# EasyEDA Pro project evenVCO.eprj, board PCB1_1
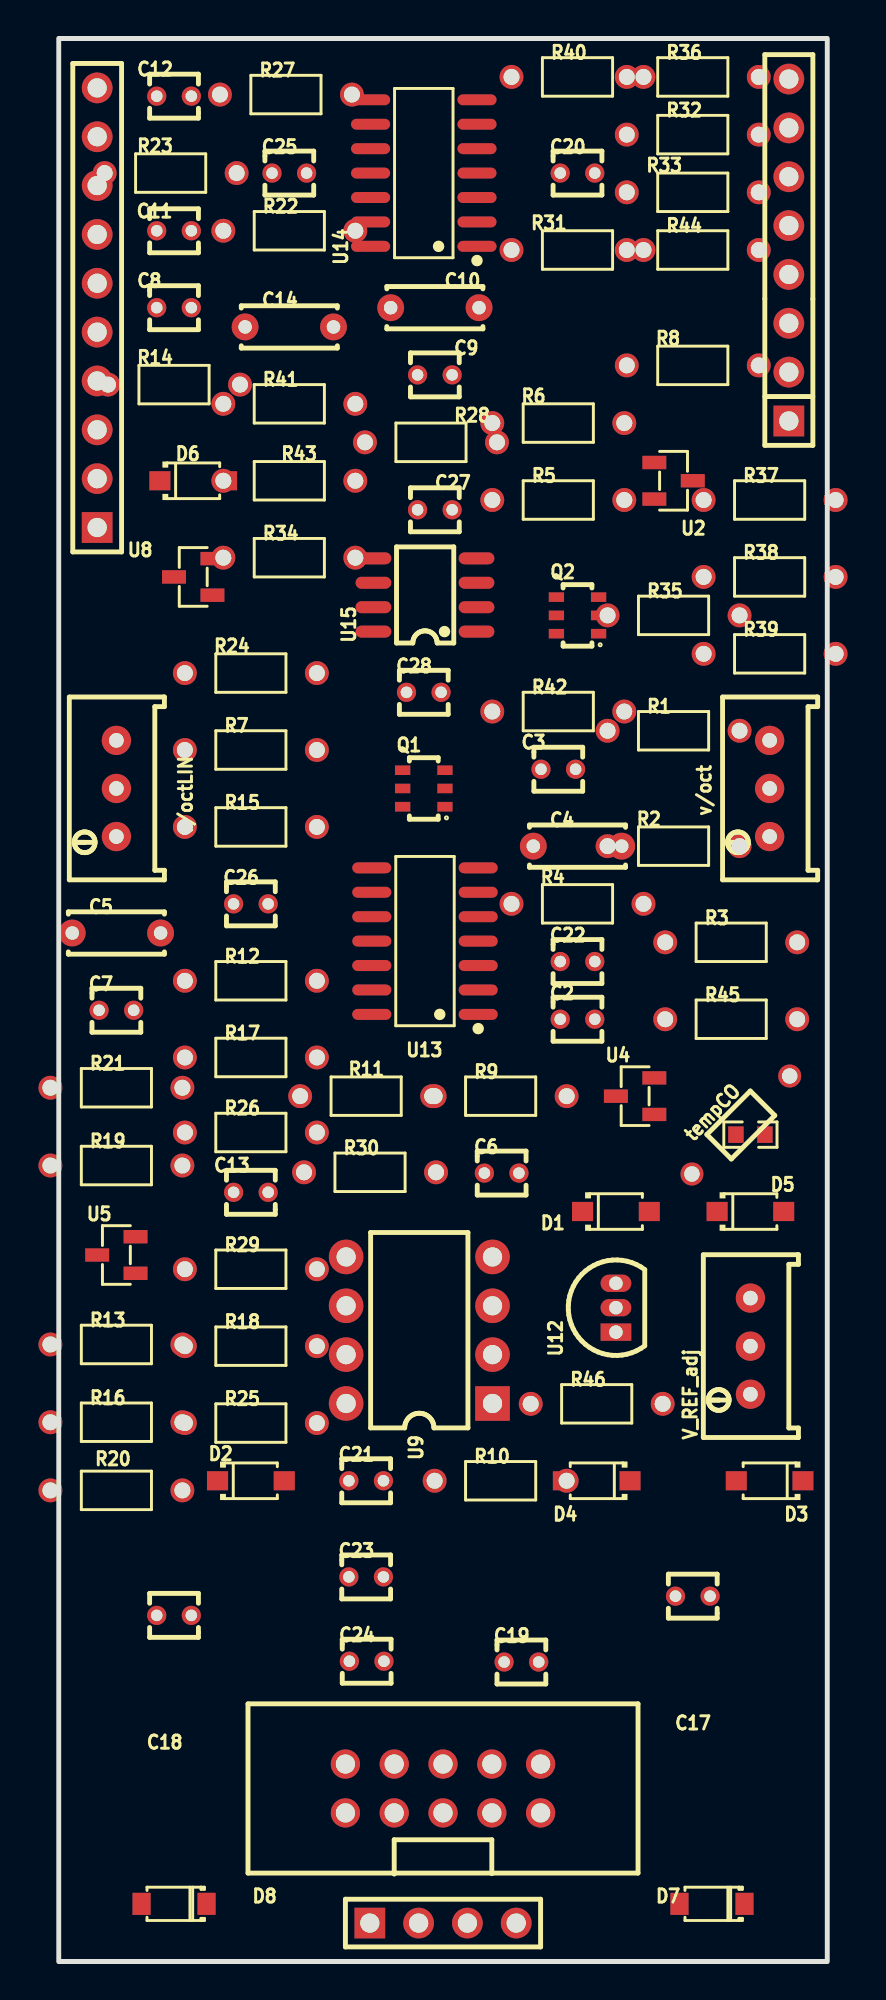
[diagram p8: board, top side]
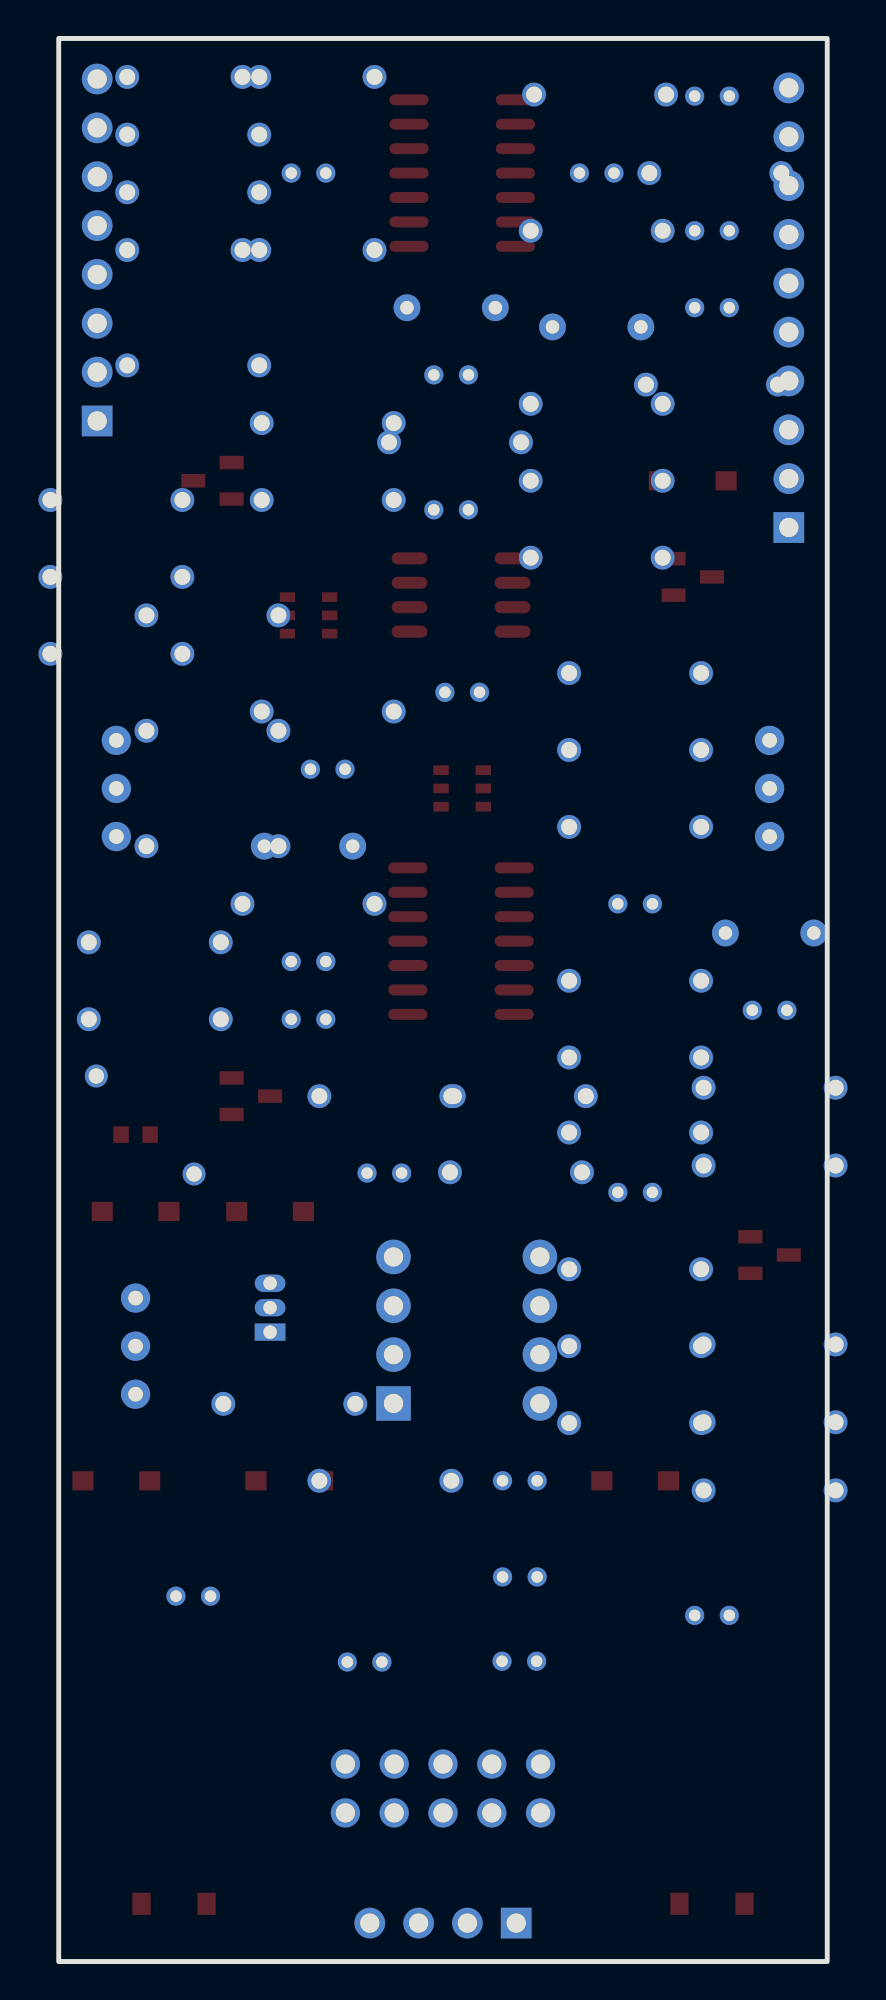
[diagram p9: board, bottom side, seen from below]

Outline 40 x 100 mm; copper layers: Top Layer, Bottom Layer. Coordinates in mm from the lower left corner of the outline.
Outline path: rectangle 0,100 40,0
Stack: Top Layer 0.035mm / Dielectric1 1.51mm FR4 er 4.5 / Bottom Layer 0.035mm

## Design rules (mm)
template: JLCPCB Capability(Two Layers Board)
spacing copperThickness1oz (default): track to track 0.102, other pairs 0.152 to 0.3
spacing copperThickness2oz: track to track 0.203, other pairs 0.152 to 0.3
track width copperThickness1oz (default): min 0.127, default 0.254, max 2.54
track width copperThickness2oz: min 0.203, default 0.254, max 2.54
differential pair differentialPair (default): width min 0.127, default 0.254, max 2.54; gap min 0.152, default 0.152
via viaSize (default): diameter min 0.5, default 0.61, max 10; hole min 0.3, default 0.305, max 6.3

## Placement (name value [footprint] x y rotation side)
C2  10nF  [CAP-TH_L2.5-W2.3-P1.80-D0.4]  27 49 0 top
C3  1nF  [CAP-TH_L2.5-W2.3-P1.80-D0.4]  26 62 0 top
C4  2.2nF styrene  [CAP-TH_L5.0-W2.1-P4.60-D0.4]  27 58 0 top
C5  680nF polyester  [CAP-TH_L5.0-W2.1-P4.60-D0.4]  3 53.48 0 top
C6  47pF  [CAP-TH_L2.5-W2.3-P1.80-D0.4]  23.05 41 0 top
C7  47pF  [CAP-TH_L2.5-W2.3-P1.80-D0.4]  3 49.47 0 top
C8  1nF  [CAP-TH_L2.5-W2.3-P1.80-D0.4]  6 86 0 top
C9  3pF  [CAP-TH_L2.5-W2.3-P1.80-D0.4]  19.58 82.51 0 top
C10  680nF  [CAP-TH_L5.0-W2.1-P4.60-D0.4]  19.58 86 0 top
C11  10pF  [CAP-TH_L2.5-W2.3-P1.80-D0.4]  6 90 180 top
C12  10pF  [CAP-TH_L2.5-W2.3-P1.80-D0.4]  6 97 180 top
C13  10pF  [CAP-TH_L2.5-W2.3-P1.80-D0.4]  10 40 180 top
C14  2.2nF  [CAP-TH_L5.0-W2.1-P4.60-D0.4]  12 85 0 top
C17  10uF  [CAP-TH_L2.5-W2.3-P1.80-D0.4]  33 19 180 top
C18  10uF  [CAP-TH_L2.5-W2.3-P1.80-D0.4]  6 18 180 top
C19  100nF  [CAP-TH_L2.5-W2.3-P1.80-D0.4]  24.08 15.58 0 top
C20  100nF  [CAP-TH_L2.5-W2.3-P1.80-D0.4]  27 93 0 top
C21  100nF  [CAP-TH_L2.5-W2.3-P1.80-D0.4]  16 25 0 top
C22  100nF  [CAP-TH_L2.5-W2.3-P1.80-D0.4]  27 52 0 top
C23  100nF  [CAP-TH_L2.5-W2.3-P1.80-D0.4]  16 20 0 top
C24  100nF  [CAP-TH_L2.5-W2.3-P1.80-D0.4]  16.03 15.62 0 top
C25  100nF  [CAP-TH_L2.5-W2.3-P1.80-D0.4]  12 93 0 top
C26  100nF  [CAP-TH_L2.5-W2.3-P1.80-D0.4]  10 55 0 top
C27  100nF  [CAP-TH_L2.5-W2.3-P1.80-D0.4]  19.58 75.49 0 top
C28  100nF  [CAP-TH_L2.5-W2.3-P1.80-D0.4]  19 66 0 top
D1  1N4148W  [SOD-123F_L2.7-W1.6-LS3.8-RD]  29 39 0 top
D2  1N4148W  [SOD-123F_L2.7-W1.6-LS3.8-RD]  10 25 0 top
D3  1N4148W  [SOD-123F_L2.7-W1.6-LS3.8-RD]  37 25 180 top
D4  1N4148W  [SOD-123F_L2.7-W1.6-LS3.8-RD]  28 25 180 top
D5  1N4148W  [SOD-123F_L2.7-W1.6-LS3.8-RD]  36 39 0 top
D6  1N4148W  [SOD-123F_L2.7-W1.6-LS3.8-RD]  7 77 0 top
D7  1N5817W  [SOD-123_L2.8-W1.8-LS3.7-RD]  34 3 180 top
D8  1N5817W  [SOD-123_L2.8-W1.8-LS3.7-RD]  6 3 180 top
H1  HTSW-110-07-G-S  [HDR-TH_TSW-110-17-F-S-LL]  2 86 90 top
H2  HTSW-108-22-T-S  [HDR-TH_HTSW-108-22-T-S]  38 89 90 top
H3  HTSW-104-18-F-S  [HDR-TH_HTSW-104-25-S-S-LL]  20 2 180 top
P1  power  [IDC-TH_10P-P2.54_C5665]  20 9 0 top
Q1  BCM847DS,115  [SC-74-6_L2.9-W1.5-P0.95-LS2.8-BR]  19 61 0 top
Q2  BCM847DS,115  [SC-74-6_L2.9-W1.5-P0.95-LS2.8-BR]  27 70 0 top
R1  95.3k  [RES-TH_BD1.8-L3.5-P7.50-D0.5]  32 64 0 top
R2  6.2k  [RES-TH_BD1.8-L3.5-P7.50-D0.5]  32 58 180 top
R3  4.22R  [RES-TH_BD1.8-L3.5-P7.50-D0.5]  35 53 0 top
R4  820k  [RES-TH_BD1.8-L3.5-P7.50-D0.5]  27 55 0 top
R5  1.5k  [RES-TH_BD1.8-L3.5-P7.50-D0.5]  26 76 0 top
R6  1.5k  [RES-TH_BD1.8-L3.5-P7.50-D0.5]  26 80 180 top
R7  510R  [RES-TH_BD1.8-L3.5-P7.50-D0.5]  10 63 0 top
R8  150k  [RES-TH_BD1.8-L3.5-P7.50-D0.5]  33 83 180 top
R9  270R  [RES-TH_BD1.8-L3.5-P7.50-D0.5]  23 45 0 top
R10  330k  [RES-TH_BD1.8-L3.5-P7.50-D0.5]  23 25 0 top
R11  22k  [RES-TH_BD1.8-L3.5-P7.50-D0.5]  16 45 180 top
R12  22k  [RES-TH_BD1.8-L3.5-P7.50-D0.5]  10 51 0 top
R13  100k  [RES-TH_BD1.8-L3.5-P7.50-D0.5]  3 32.09 0 top
R14  47k  [RES-TH_BD1.8-L3.5-P7.50-D0.5]  6 82 0 top
R15  2M  [RES-TH_BD1.8-L3.5-P7.50-D0.5]  10 59 0 top
R16  100k  [RES-TH_BD1.8-L3.5-P7.50-D0.5]  3 28.04 0 top
R17  100k  [RES-TH_BD1.8-L3.5-P7.50-D0.5]  10 47.01 0 top
R18  10K  [RES-TH_BD1.8-L3.5-P7.50-D0.5]  10 32 0 top
R19  82k  [RES-TH_BD1.8-L3.5-P7.50-D0.5]  3 41.39 0 top
R20  100K  [RES-TH_BD1.8-L3.5-P7.50-D0.5]  3 24.5 0 top
R21  100k  [RES-TH_BD1.8-L3.5-P7.50-D0.5]  3 45.44 0 top
R22  100k  [RES-TH_BD1.8-L3.5-P7.50-D0.5]  12 90 0 top
R23  200k  [RES-TH_BD1.8-L3.5-P7.50-D0.5]  5.82 93 0 top
R24  220k  [RES-TH_BD1.8-L3.5-P7.50-D0.5]  10 67 180 top
R25  2.2k  [RES-TH_BD1.8-L3.5-P7.50-D0.5]  10 28 0 top
R26  430k  [RES-TH_BD1.8-L3.5-P7.50-D0.5]  10 43.11 0 top
R27  220k  [RES-TH_BD1.8-L3.5-P7.50-D0.5]  11.82 97.08 0 top
R28  100k  [RES-TH_BD1.8-L3.5-P7.50-D0.5]  19.37 79 0 top
R29  100k  [RES-TH_BD1.8-L3.5-P7.50-D0.5]  10 36 0 top
R30  100k  [RES-TH_BD1.8-L3.5-P7.50-D0.5]  16.2 41.04 0 top
R31  22k  [RES-TH_BD1.8-L3.5-P7.50-D0.5]  27 89 180 top
R32  10K  [RES-TH_BD1.8-L3.5-P7.50-D0.5]  33 95 0 top
R33  20k  [RES-TH_BD1.8-L3.5-P7.50-D0.5]  33 92 0 top
R34  10K  [RES-TH_BD1.8-L3.5-P7.50-D0.5]  12 73 0 top
R35  1k  [RES-TH_BD1.8-L3.5-P7.50-D0.5]  32 70 0 top
R36  22k  [RES-TH_BD1.8-L3.5-P7.50-D0.5]  33 98 0 top
R37  390  [RES-TH_BD1.8-L3.5-P7.50-D0.5]  37 76 0 top
R38  43k  [RES-TH_BD1.8-L3.5-P7.50-D0.5]  37 72 0 top
R39  43k  [RES-TH_BD1.8-L3.5-P7.50-D0.5]  37 68 0 top
R40  1k  [RES-TH_BD1.8-L3.5-P7.50-D0.5]  27 98 0 top
R41  10K  [RES-TH_BD1.8-L3.5-P7.50-D0.5]  12 81 0 top
R42  10K  [RES-TH_BD1.8-L3.5-P7.50-D0.5]  26 65 0 top
R43  10K  [RES-TH_BD1.8-L3.5-P7.50-D0.5]  12 77 0 top
R44  100k  [RES-TH_BD1.8-L3.5-P7.50-D0.5]  33 89 0 top
R45  10K  [RES-TH_BD1.8-L3.5-P7.50-D0.5]  35 49 0 top
R46  1k  [RES-TH_BD1.8-L3.5-P7.50-D0.5]  28 29 0 top
RTemp  10kΩ  [RES-TH_BD1.8-L3.2-P7.20-D0.4]  35.5 43.5 45 top
tempCO  100R_3500ppm  [R0603]  36 43 0 top
U2  2N3906(ZA)PNP  [SOT-23-3_L2.9-W1.3-P0.95-LS2.4-BR]  32 77 180 top
U4  2N3904S(ZC)NPN  [SOT-23-3_L2.9-W1.3-P0.95-LS2.4-BR]  30 45 0 top
U5  2N3904S(ZC)NPN  [SOT-23-3_L2.9-W1.3-P0.95-LS2.4-BR]  3 36.74 0 top
U8  2N3904S(ZC)NPN  [SOT-23-3_L2.9-W1.3-P0.95-LS2.4-BR]  7 72 0 top
U9  LM393N  [DIP-8_L9.7-W6.4-P2.54-LS7.6-BL]  18.77 32.83 90 top
U12  LM336  [TO-92-3_L4.9-W3.7-P1.27-L]  29 34 90 top
U13  TL084CDR  [SOIC-14_L8.7-W3.9-P1.27-LS6.0-BL]  19.06 53.06 90 top
U14  TL084CDR  [SOIC-14_L8.7-W3.9-P1.27-LS6.0-BL]  19 93 90 top
U15  TL082  [SOP-8_L4.9-W3.9-P1.27-LS6.0-BL]  19.06 71.06 90 top
v/oct  10kΩ  [RES-ADJ-TH_3P-L10.0-W10.0-P2.50-L]  37 61 90 top
v/octLIN  1kΩ  [RES-ADJ-TH_3P-L10.0-W10.0-P2.50-L]  3 61 90 top
V_REF_adj  10kΩ  [RES-ADJ-TH_3P-L10.0-W10.0-P2.50-L]  36 32 90 top

## Footprints (pads in the part's own frame, mm; a bottom-side part is the same pattern mirrored in y, then rotated)
CAP-TH_L2.5-W2.3-P1.80-D0.4
  round 1 hole 0.6: 1(-0.9,0) 2(0.9,0)
CAP-TH_L5.0-W2.1-P4.60-D0.4
  round 1.4 hole 0.7: 1(-2.3,0) 2(2.3,0)
DIP-8_L9.7-W6.4-P2.54-LS7.6-BL
  rect 1.8x1.8 hole 1: 1(-3.81,-3.81)
  round 1.8 hole 1: 2(-1.27,-3.81) 3(1.27,-3.81) 4(3.81,-3.81) 5(3.81,3.81) 6(1.27,3.81) 7(-1.27,3.81) 8(-3.81,3.81)
HDR-TH_HTSW-104-25-S-S-LL
  rect 1.6x1.6 hole 1: 1(3.81,0)
  round 1.6 hole 1: 2(1.27,0) 3(-1.27,0) 4(-3.81,0)
HDR-TH_HTSW-108-22-T-S
  rect 1.6x1.6 hole 1: 1(-8.89,0)
  round 1.6 hole 1: 2(-6.35,0) 3(-3.81,0) 4(-1.27,0) 5(1.27,0) 6(3.81,0) 7(6.35,0) 8(8.89,0)
HDR-TH_TSW-110-17-F-S-LL
  rect 1.6x1.6 hole 1: 1(-11.43,0)
  round 1.6 hole 1: 2(-8.89,0) 3(-6.35,0) 4(-3.81,0) 5(-1.27,0) 6(1.27,0) 7(3.81,0) 8(6.35,0) 9(8.89,0) 10(11.43,0)
IDC-TH_10P-P2.54_C5665
  round 1.524 hole 1: 1(-5.08,-1.27) 2(-5.08,1.27) 3(-2.54,-1.27) 4(-2.54,1.27) 5(0,-1.27) 6(0,1.27) 7(2.54,-1.27) 8(2.54,1.27) 9(5.08,-1.27) 10(5.08,1.27)
R0603
  rect 0.806x0.864 smd: 1(-0.753,0) 2(0.753,0)
RES-ADJ-TH_3P-L10.0-W10.0-P2.50-L
  round 1.524 hole 0.762: 1(-2.5,0) 2(0,0) 3(2.5,0)
RES-TH_BD1.8-L3.2-P7.20-D0.4
  round 1.2 hole 0.8: 1(-3.6,0) 2(3.6,0)
RES-TH_BD1.8-L3.5-P7.50-D0.5
  round 1.245 hole 0.83: 1(-3.435,0) 2(3.435,0)
SC-74-6_L2.9-W1.5-P0.95-LS2.8-BR
  rect 0.8x0.5 smd: 1(1.1,-0.95) 2(1.1,0) 3(1.1,0.95) 4(-1.1,0.95) 5(-1.1,0) 6(-1.1,-0.95)
SOD-123_L2.8-W1.8-LS3.7-RD
  rect 0.95x1.15 smd: 1(-1.692,0) 2(1.692,0)
SOD-123F_L2.7-W1.6-LS3.8-RD
  rect 1.1x1 smd: 1(-1.735,0) 2(1.735,0)
SOIC-14_L8.7-W3.9-P1.27-LS6.0-BL
  oval 0.574x2.038 smd: 1(-3.81,-2.769) 2(-2.54,-2.769) 3(-1.27,-2.769) 4(0,-2.769) 5(1.27,-2.769) 6(2.54,-2.769) 7(3.81,-2.769) 8(3.81,2.769) 9(2.54,2.769) 10(1.27,2.769) 11(0,2.769) 12(-1.27,2.769) 13(-2.54,2.769) 14(-3.81,2.769)
SOP-8_L4.9-W3.9-P1.27-LS6.0-BL
  oval 0.63x1.865 smd: 1(-1.905,-2.683) 2(-0.635,-2.683) 3(0.635,-2.683) 4(1.905,-2.683) 5(1.905,2.683) 6(0.635,2.683) 7(-0.635,2.683) 8(-1.905,2.683)
SOT-23-3_L2.9-W1.3-P0.95-LS2.4-BR
  rect 1.25x0.7 smd: 1(1,-0.95) 2(1,0.95) 3(-1,0)
TO-92-3_L4.9-W3.7-P1.27-L
  rect 0.9x1.6 hole 0.7: 1(-1.27,0)
  oval 0.9x1.6 hole 0.7: 2(0,0) 3(1.27,0)

## Nets
As in the schematic.
